# Altium schematic sheet 09 - mPCIE.SchDoc
size 420 x 297 mm
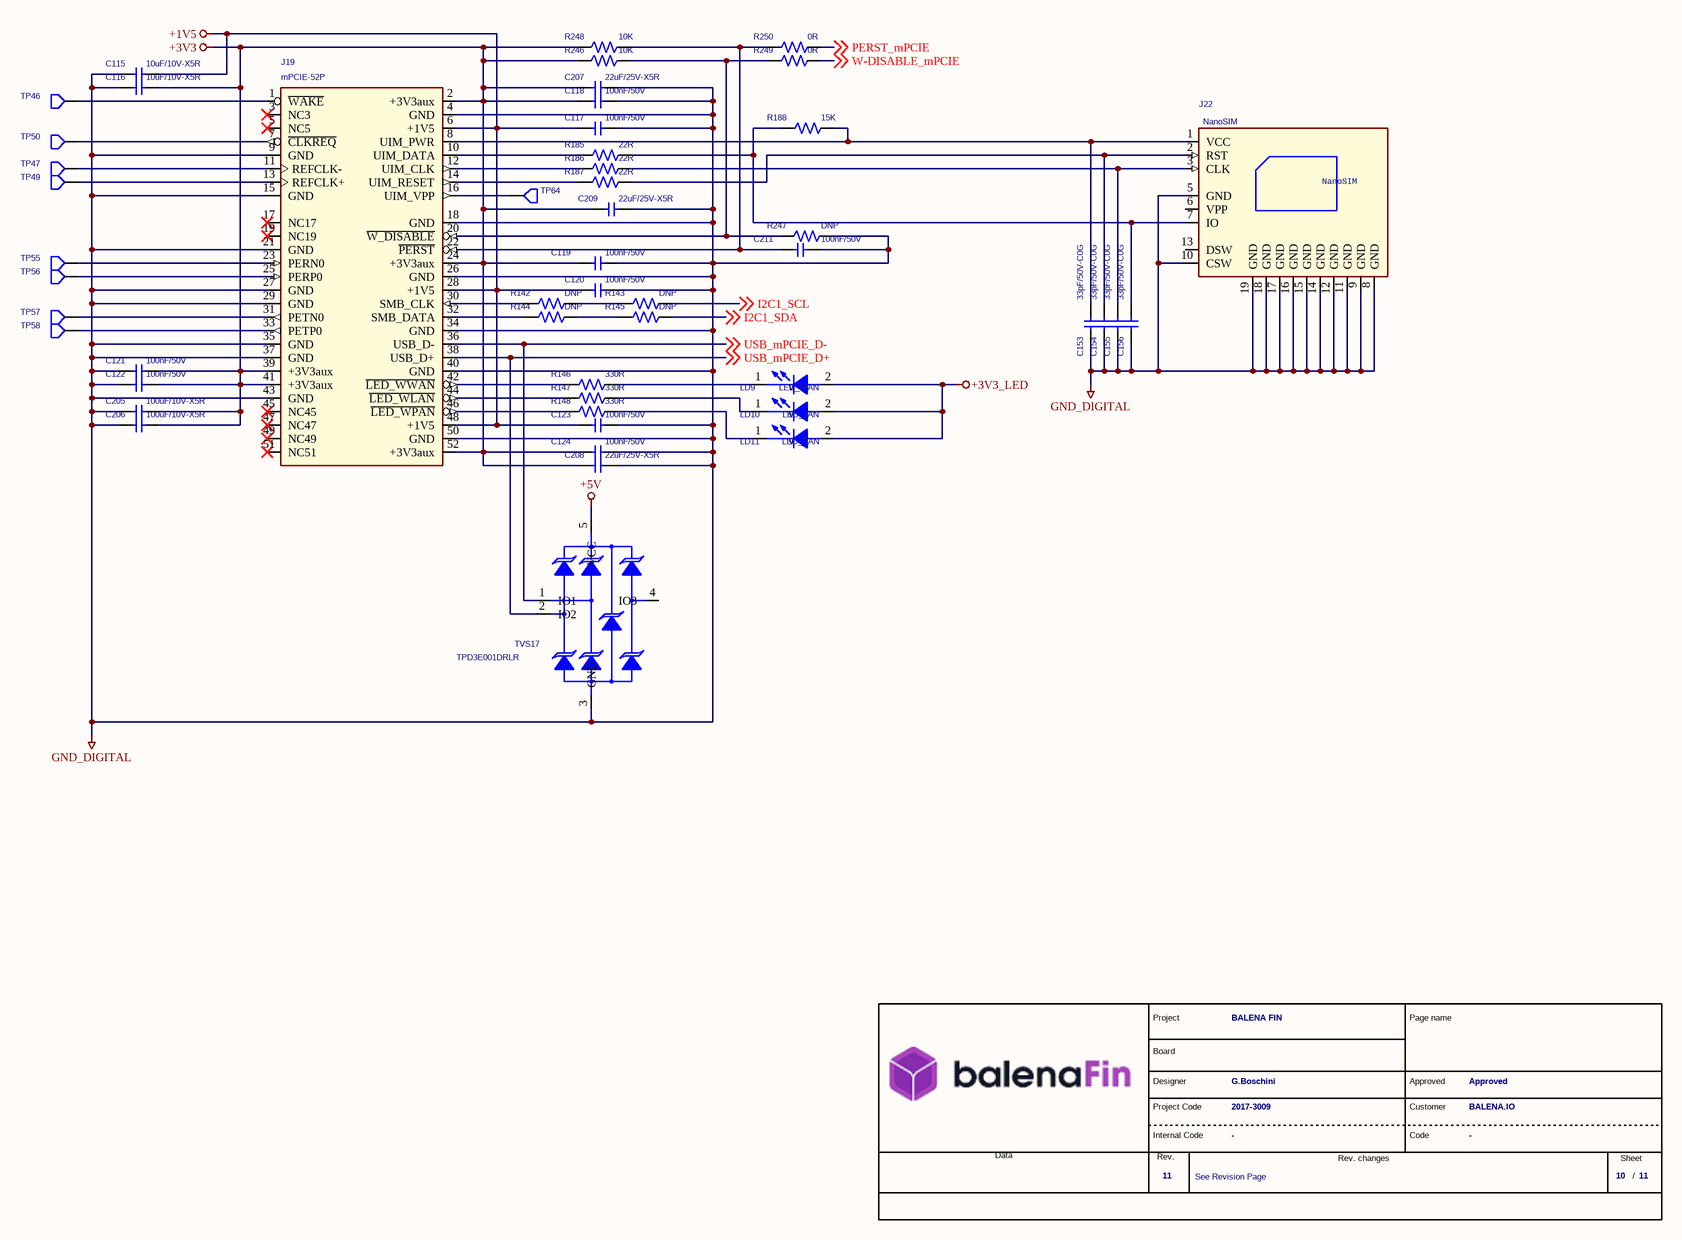
[diagram p0: 09 - mPCIE.SchDoc]

## Parts
*  Revision: 11  FAE RD code: 2017-3009  DocumentoRev: See Revision Page  Page Number: 10  Nome Progetto: BALENA FIN  Customer name: BALENA.IO  Project manager: Approved  Project designer: G.Boschini  (hidden comment: MyFAEVuoto)  (graphical)
C115  10uF/10V-X5R  [CS-C-0603]
C116  10uF/10V-X5R  [CS-C-0603]
C117  100nF/50V  [CS-C-0402]
C118  100nF/50V  [CS-C-0402]
C119  100nF/50V  [CS-C-0402]
C120  100nF/50V  [CS-C-0402]
C121  100nF/50V  [CS-C-0402]
C122  100nF/50V  [CS-C-0402]
C123  100nF/50V  [CS-C-0402]
C124  100nF/50V  [CS-C-0402]
C153  33pF/50V-C0G  [CS-C-0402]
C154  33pF/50V-C0G  [CS-C-0402]
C155  33pF/50V-C0G  [CS-C-0402]
C156  33pF/50V-C0G  [CS-C-0402]
C205  100uF/10V-X5R  [CS-C-1210]
C206  100uF/10V-X5R  [CS-C-1210]
C207  22uF/25V-X5R  [CS-C-1206]
C208  22uF/25V-X5R  [CS-C-1206]
C209  22uF/25V-X5R  [CS-C-1206]
C211  100nF/50V  [CS-C-0402]
J19  mPCIE-52P  [J-26X2-0080-FOS-2041119]
J22  NanoSIM  [J-NANOSIM-SF72S006VBA]
LD9  LED_WAN  [LD-0603]
LD10  LED_LAN  [LD-0603]
LD11  LED_PAN  [LD-0603]
R142  DNP  [RS-0402]
R143  DNP  [RS-0402]
R144  DNP  [RS-0402]
R145  DNP  [RS-0402]
R146  330R  [RS-0402]
R147  330R  [RS-0402]
R148  330R  [RS-0402]
R185  22R  [RS-0603]
R186  22R  [RS-0603]
R187  22R  [RS-0603]
R188  15K  [RS-0402]
R246  10K  [RS-0402]
R247  DNP  [RS-0402]
R248  10K  [RS-0402]
R249  0R  [RS-0402]
R250  0R  [RS-0402]
TP46  TPS  [TPS-0100]  (value not drawn)  (no BOM)
TP47  TPS  [TPS-0100]  (value not drawn)  (no BOM)
TP49  TPS  [TPS-0100]  (value not drawn)  (no BOM)
TP50  TPS  [TPS-0100]  (value not drawn)  (no BOM)
TP55  TPS  [TPS-0100]  (value not drawn)  (no BOM)
TP56  TPS  [TPS-0100]  (value not drawn)  (no BOM)
TP57  TPS  [TPS-0100]  (value not drawn)  (no BOM)
TP58  TPS  [TPS-0100]  (value not drawn)  (no BOM)
TP64  TPS  [TPS-0100]  (value not drawn)  (no BOM)
TVS17  TPD3E001DRLR  [SOP5_USON6]

## Nets
+1V5: C115.2 C117.1 C120.1 C123.1 J19.6(+1V5) J19.28(+1V5) J19.48(+1V5)
+3V3: C116.2 C118.1 C119.1 C121.2 C122.2 C124.1 C205.2 C206.2 C207.1 C208.1 C209.1 J19.2(+3V3aux) J19.24(+3V3aux) J19.39(+3V3aux) J19.41(+3V3aux) J19.52(+3V3aux) R246.2 R248.2
+3V3_LED: LD9.2(A) LD10.2(A) LD11.2(A)
+5V: TVS17.5(VCC)
GND_DIGITAL: C115.1 C116.1 C117.2 C118.2 C119.2 C120.2 C121.1 C122.1 C123.2 C124.2 C153.2 C154.2 C155.2 C156.2 C205.1 C206.1 C207.2 C208.2 C209.2 C211.2 J19.4(GND) J19.9(GND) J19.15(GND) J19.18(GND) J19.21(GND) J19.26(GND) J19.27(GND) J19.29(GND) J19.34(GND) J19.35(GND) J19.37(GND) J19.40(GND) J19.43(GND) J19.50(GND) J22.5(GND) J22.8(GND) J22.9(GND) J22.10(CSW) J22.11(GND) J22.12(GND) J22.14(GND) J22.15(GND) J22.16(GND) J22.17(GND) J22.18(GND) J22.19(GND) R247.1 TVS17.3(GND)
I2C1_SCL: R143.2 ; off-sheet I2C1_SCL
I2C1_SDA: R145.2 ; off-sheet I2C1_SDA
PERST_mPCIE: R250.2 ; off-sheet PERST_mPCIE
USB_mPCIE_D+: J19.38(USB_D+) TVS17.2(IO2) ; off-sheet USB_mPCIE_D+
USB_mPCIE_D-: J19.36(USB_D-) TVS17.1(IO1) ; off-sheet USB_mPCIE_D-
W-DISABLE_mPCIE: R249.2 ; off-sheet W-DISABLE_mPCIE
NetC153_1: C153.1 J19.8(UIM_PWR) J22.1(VCC) R188.2
NetC154_1: C154.1 J22.2(RST) R187.2
NetC155_1: C155.1 J22.3(CLK) R186.2
NetC156_1: C156.1 J22.7(IO) R185.2 R188.1
NetC211_1: C211.1 J19.22(~{PERST}) R248.1 R250.1
NetJ19_1: J19.1(~{WAKE}) TP46.1(TP)
NetJ19_7: J19.7(~{CLKREQ}) TP50.1(TP)
NetJ19_10: J19.10(UIM_DATA) R185.1
NetJ19_11: J19.11(REFCLK-) TP47.1(TP)
NetJ19_12: J19.12(UIM_CLK) R186.1
NetJ19_13: J19.13(REFCLK+) TP49.1(TP)
NetJ19_14: J19.14(UIM_RESET) R187.1
NetJ19_16: J19.16(UIM_VPP) TP64.1(TP)
NetJ19_20: J19.20(~{W_DISABLE}) R246.1 R247.2 R249.1
NetJ19_23: J19.23(PERN0) TP55.1(TP)
NetJ19_25: J19.25(PERP0) TP56.1(TP)
NetJ19_30: J19.30(SMB_CLK) R142.1
NetJ19_31: J19.31(PETN0) TP57.1(TP)
NetJ19_32: J19.32(SMB_DATA) R144.1
NetJ19_33: J19.33(PETP0) TP58.1(TP)
NetJ19_42: J19.42(~{LED_WWAN}) R146.1
NetJ19_44: J19.44(~{LED_WLAN}) R147.1
NetJ19_46: J19.46(~{LED_WPAN}) R148.1
NetLD9_1: LD9.1(C) R146.2
NetLD10_1: LD10.1(C) R147.2
NetLD11_1: LD11.1(C) R148.2
NetR142_2: R142.2 R143.1
NetR144_2: R144.2 R145.1

Not connected (* = marked no-connect by the designer): J19 3(NC3)* 5(NC5)* 17(NC17)* 19(NC19)* 45(NC45)* 47(NC47)* 49(NC49)* 51(NC51)*; J22 6(VPP) 13(DSW); TVS17 4(IO3)

## Notes on the sheet
- (in symbol LED V - GENERICO - 0603) V
- (in symbol MyFAEVuoto) Project; Page name; Board; Designer; Project Code; Customer; Internal Code; Code; Data; Rev.; Rev. changes; Sheet; /

## Library data of the parts
C115 C116 = CS-C-0603-10u/10V-X5R: CHIP CAP.CER. 10uF 10V 10% X5R 0603; MPN: Generic; Pkg Type: SMD; Room: mPCIE; Mount: Yes
C117-C124 C211 = CS-C-0402-100n/16V: CHIP CAP.CER. 100nF 16V 10% X7R 0402; MPN: Generic; Alternative MPN: C0402C104K4RACTU; Room: mPCIE; Pkg Type: SMD; Mount: Yes
C153-C156 = CS-C-0402-33p/50V-C0G: CHIP CAP.CER. 33pF 50V 5% C0G 0402; MPN: Generic; Room: NANO-SIM; Pkg Type: SMD; Mount: Yes
C205 C206 = CS-C-1210-100u/10V-X5R: CHIP CAP.CER. 100UF 10V 20% X5R 1210; MPN: Generic; Pkg Type: SMD; Room: mPCIE; Mount: Yes
C207-C209 = CS-C-1206-22u/25V-X5R: CHIP CAP.CER. 22uF 25V 10% X5R 1206; MPN: Generic; Room: mPCIE; Pkg Type: SMD; Temperature range: -55°..+85°; Mount: Yes
J19 = mPCIE - J-26X2-0080-FOS-2041119: CONN PCI EXP MINI FEMALE 52POS; MPN: 2041119-1; Pkg Type: SMD; Note: 0.5A/50VAC; Room: mPCIE; Temperature range: -55°..+85°; Mount: Yes
J22 = NANOSIM - J-NANOSIM-SF72S006VBA: CONN NANO SIM CARD PUSH-PUSH; MPN: SF72S006VBAR2500; Alternative MPN: SF72S006VBDR2500; Pkg Type: SMD; Room: NANO-SIM; Temperature range: -25°..+85°; Mount: Yes
LD9-LD11 = LED V - GENERICO - 0603: LED Green 0603 SMT; Alternative MPN: KP-1608SGC; Pkg Type: SMD; Note: V=2.2V/20mA; MPN: Generic; Mount: Yes
R142-R145 = RS-0402: CHIP RES. 0402; MPN: Generic; Pkg Type: SMD; Mount: No
R146-R148 = RS-0402-330r: CHIP RES. 330R 0402 1/16W 1%; MPN: Generic; Pkg Type: SMD; Room: mPCIE; Mount: Yes
R185-R187 = RS-0603-22r: CHIP RES. 22R 0603 1/16W 1%; MPN: Generic; Pkg Type: SMD; Room: NANO-SIM; Mount: Yes
R188 = RS-0402-15k: CHIP RES. 15K 0402 1/16W 1%; MPN: Generic; Pkg Type: SMD; Room: NANO-SIM; Temperature range: -55°..+155°; Mount: Yes
R246 R248 = RS-0402-10k: CHIP RES. 10K 0402 1/16W 1%; MPN: Generic; Room: mPCIE; Pkg Type: SMD; Temperature range: -55°..+125°; Mount: Yes
R247 = RS-0402: CHIP RES. 0402; MPN: Generic; Pkg Type: SMD; Room: mPCIE; Mount: No
R249 R250 = RS-0402-0r: CHIP RES. 0R 0402 1/16W 1%; MPN: Generic; Room: mPCIE; Pkg Type: SMD; Mount: Yes
TP46 TP47 TP49 TP50 TP55-TP58 TP64 = TEST POINT SMD 1 MM: TEST POINT SMD; MPN: TP-No-BoM; Room: mPCIE; Pkg Type: SMD; Mount: Yes
TVS17 = TVS-UNI3x - TPD3E001DRLR - USB: TVS DIODE 5.5VWM; Note: Unidirectional - High-Speed Data Interface - USB; Pkg Type: SMD; Room: mPCIE; Temperature range: -40°..+85°; MPN: TPD3E001DRLR; Mount: Yes
* = MyFAEVuoto: Page Count: 11; Customer Code: -; Database: -